# Altium schematic sheet MainSchema.SchDoc
size A4
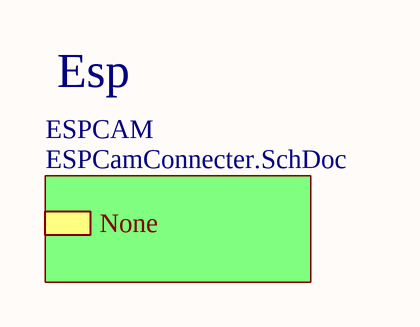
[diagram p0: MainSchema.SchDoc]

## Sub-sheets
ESPCAM = ESPCamConnecter.SchDoc: None

## Notes on the sheet
- Esp